# Altium schematic sheet Power.SchDoc: Plant - Power
size A4; Author: Carlos de la Fuente; CompanyName: ekuore; DrawnBy: Carlos de la Fuente; Engineer: Carlos de la Fuente; Organization: eKuore; Revision: 0.2; SheetNumber: 3; SheetTotal: 5
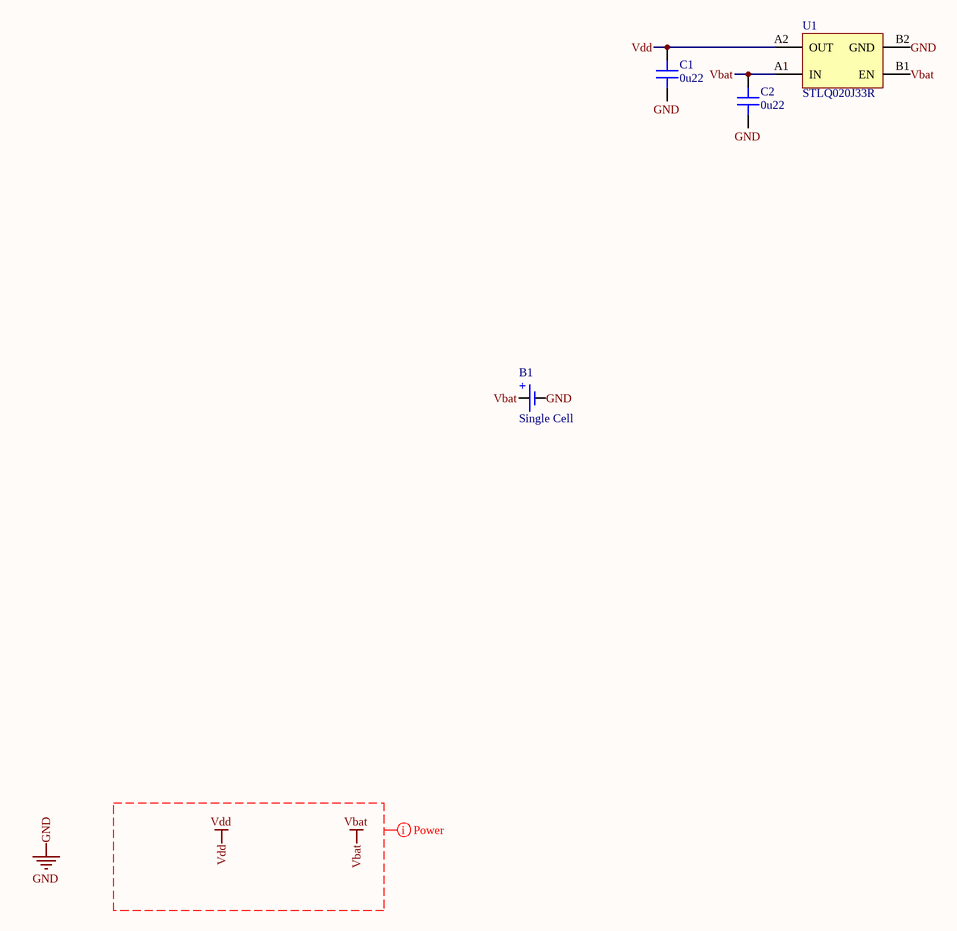
[diagram p0: Power.SchDoc]

## Parts
B1  Single Cell  [LINX BAT-HLD-012-SMT]
C1  0u22  [CAP 0201/0603]
C2  0u22  [CAP 0201/0603]
U1  STLQ020J33R  [ST flip-chip4]

## Nets
GND: B1.2(-) C1.1 C2.1 U1.B2(GND)
Vbat: B1.1(+) C2.2 U1.A1(IN) U1.B1(EN)
Vdd: C1.2 U1.A2(OUT)

## Layout directives
net class Power: Vbat, Vdd

## Notes on the sheet
- Title
- Size:
- Date:
- A4
- Project:
- Time:
- Sheet
- Drawn By:
- Revision:
- of
- File:

## Library data of the parts
B1 = BAT-HLD-012-SMT: CR1216, CR1225 Battery; Manufacturer: Linx; Number of Cells: 1; Part Number: BAT-HLD-012-SMT; Value: Battery; Revision Date: 22/06/2021; Creation Date: 22/06/2021; Supplier 1: Digi-Key; Supplier Part Number 1: BAT-HLD-012-SMT-ND; Manufacturer Part Number: BAT-HLD-012-SMT; Stock 1: 3192; RoHS: Yes; ComponentLink1URL: https://datasheet.ciiva.com/4642/bat-hld-012-smt20; ComponentLink1Description: https://datasheet.ciiva.com/4642/bat-hld-012-smt20; ComponentLink2URL: https://datasheet.ciiva.com/4/bat-hld-012-smt-4040; ComponentLink2Description: https://datasheet.ciiva.com/4/bat-hld-012-smt-4040; ComponentLink3URL: https://datasheet.ciiva.com/16418/bat-hld-012-smt-; ComponentLink3Description: https://datasheet.ciiva.com/16418/bat-hld-012-smt-; Manufacturer 1: Linx; Manufacturer Part Number 1: BAT-HLD-012-SMT; Mount: Surface Mount,PCB; Termination: SMD/SMT; Number of Batteries: 1; Package Quantity: 1000; Lead Free: Lead Free
C1 C2 = GRM033R61A224KE90D: CAP CER 0201 0.22uF 10V 10% X5R; Manufacturer: Murata; Note: recommended; Capacitance: 220nF; Value: 0u22; Part Number: GRM033R61A224KE90D; Creation Date: 19/01/2021; Revision Date: 19/01/2021; Supplier 1: Digi-Key; Supplier Part Number 1: 490-10411-1-ND; Manufacturer Part Number: GRM033R61A224KE90D; Stock 1: 951885; Pricing 1: 1=0,10000, 10=0,03600, 50=0,01980, 100=0,01620, 500=0,01156, 1000=0,00908, 2500=0,00825, 5000=0,00759 (USD); RoHS: Yes; Mount: Surface Mount; Case/Package: 0201; Min Operating Temperature: -55°C; Max Operating Temperature: 85°C; Tolerance: 10%; Packaging: Tape and Reel; Voltage Rating (DC): 10V; Length: 0.024inch; Height: 0.5mm; Width: 0.012inch; Lead Free: Lead Free; ComponentLink1URL: http://www.farnell.com/datasheets/2867835.pdf?src-supplier=Farnell; ComponentLink1Description: http://www.farnell.com/datasheets/2867835.pdf?src-supplier=Farnell; Case Code (Imperial): 0201; Case Code (Metric): 0603; Voltage Rating: 10V; Dielectric: X5R; Thickness: 0.013inch; ComponentLink2URL: http://www.mouser.com/ds/2/281/c02e-2905.pdf?src-s; ComponentLink2Description: http://www.mouser.com/ds/2/281/c02e-2905.pdf?src-s; ComponentLink3URL: http://search.murata.co.jp/Ceramy/image/img/A01X/G; ComponentLink3Description: http://search.murata.co.jp/Ceramy/image/img/A01X/G; ComponentLink4URL: http://www.farnell.com/datasheets/2867835.pdf?src-; ComponentLink4Description: http://www.farnell.com/datasheets/2867835.pdf?src-; ComponentLink5URL: http://www.mouser.com/ds/2/281/c02e-2905.pdf?src-s; ComponentLink5Description: http://www.mouser.com/ds/2/281/c02e-2905.pdf?src-s; ComponentLink6URL: http://search.murata.co.jp/Ceramy/image/img/A01X/G; ComponentLink6Description: http://search.murata.co.jp/Ceramy/image/img/A01X/G; ComponentLink7URL: http://search.murata.co.jp/Ceramy/image/img/A01X/p; ComponentLink7Description: http://search.murata.co.jp/Ceramy/image/img/A01X/p; Manufacturer 1: Murata; Manufacturer Part Number 1: GRM033R61A224KE90D; RoHS Compliant: Yes; Resistor Type: Ceramic
U1 = STLQ020J33R: IC REG LIN 3.3V 200MA 4FLIPCHIP; Manufacturer: STMicroelectronics; Part Number: STLQ020J33R; Revision Date: 28/10/2019; Creation Date: 28/10/2019; Supplier 1: Digi-Key; Supplier Part Number 1: 497-18117-1-ND; Manufacturer Part Number: STLQ020J33R; Stock 1: 2546; Pricing 1: 1=0,57000, 10=0,49100, 100=0,36680, 500=0,28820, 1; RoHS: No; ComponentLink1URL: https://www.st.com/resource/en/datasheet/stlq020.p; ComponentLink1Description: https://www.st.com/resource/en/datasheet/stlq020.p